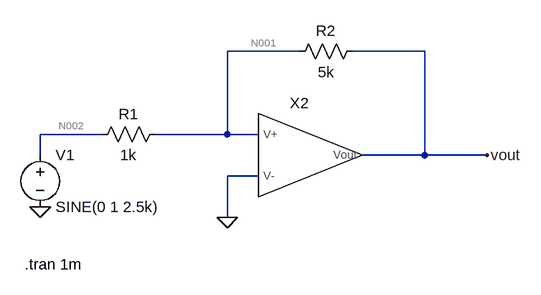
[diagram p0: schematic Inverting_Amplifer.asc]
Inverting_Amplifer.asc, the LTspice schematic file:
Version 4
SHEET 1 880 680
WIRE 144 16 32 16
WIRE 336 16 224 16
WIRE -160 144 -256 144
WIRE 32 144 32 16
WIRE 32 144 -80 144
WIRE 80 144 32 144
WIRE -256 176 -256 144
WIRE 336 176 336 16
WIRE 336 176 240 176
WIRE 432 176 336 176
WIRE 80 208 32 208
WIRE 32 272 32 208
FLAG -256 256 0
FLAG 432 176 vout
FLAG 32 272 0
SYMBOL res -64 128 R90
WINDOW 0 0 56 VBottom 2
WINDOW 3 32 56 VTop 2
SYMATTR InstName R1
SYMATTR Value 1k
SYMBOL res 240 0 R90
WINDOW 0 0 56 VBottom 2
WINDOW 3 32 56 VTop 2
SYMATTR InstName R2
SYMATTR Value 5k
SYMBOL voltage -256 160 R0
WINDOW 123 0 0 Left 2
WINDOW 39 0 0 Left 2
SYMATTR InstName V1
SYMATTR Value SINE(0 1 2.5k)
SYMBOL MY_IDEAL_opamp 144 176 R0
SYMATTR InstName X2
TEXT -280 344 Left 2 !.tran 1m

The netlist it stands for:
* Inverting_Amplifer.asc
R1 N001 N002 1k
R2 vout N001 5k
V1 N002 0 SINE(0 1 2.5k)
XX2 N001 0 vout MY_IDEAL_opamp  ; pins V+ V- Vout
.tran 1m
.backanno
.end

* Results of the author's LTspice run, read from the files saved beside the schematic
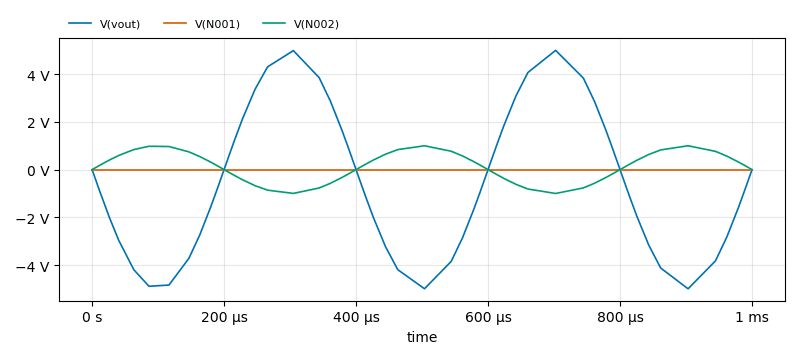
[diagram p1: Transient Analysis of Inverting_Amplifer.asc, plotted from the saved traces]
* Transient Analysis, 1 run:
*   V(vout): min -4.988 V, max 4.99 V, average -627.6 mV, rms 3.472 V, last 0 V
*   V(N001): min -499 nV, max 498.8 nV, average 62.76 nV, rms 347.2 nV, last 0 V
*   V(N002): min -998.2 mV, max 997.7 mV, average 125.5 mV, rms 694.5 mV, last 0 V